# EAGLE design 2560_breakout (EAGLE 8.1.0)
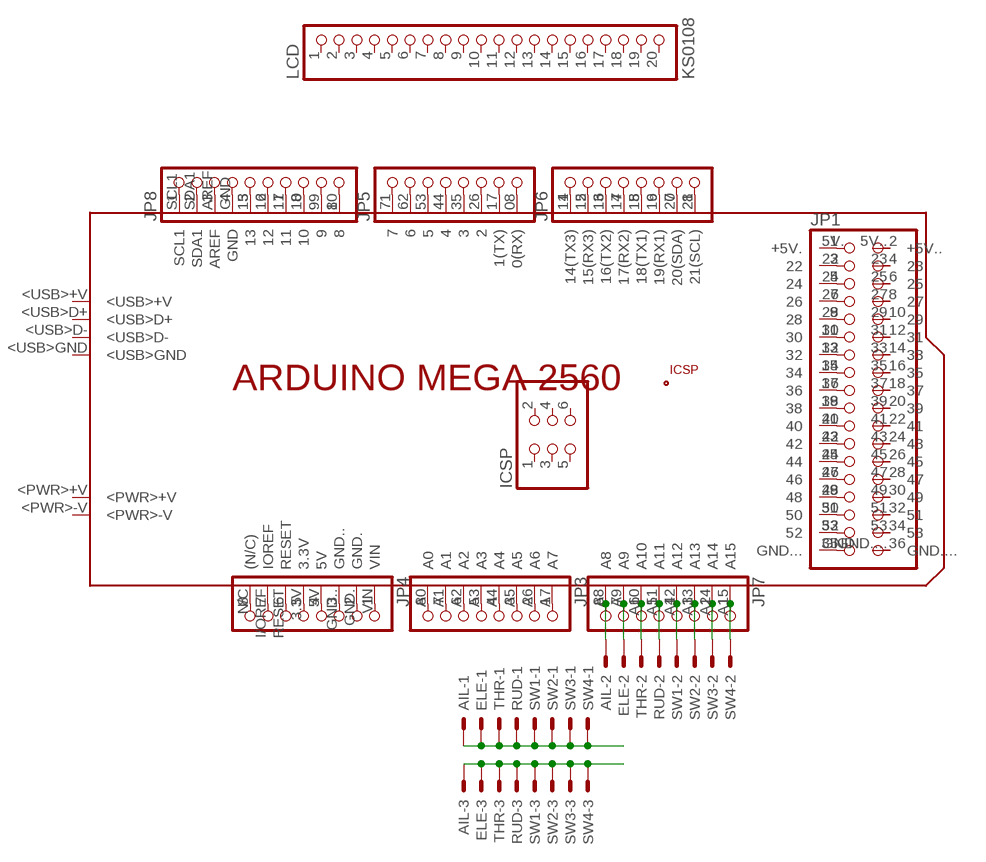
[diagram p0: schematic, sheet 1]

## Parts
AIL  JST-XH-03-PIN-LONG-PAD  [JST-XH-03-PACKAGE-LONG-PAD]
ELE  JST-XH-03-PIN-LONG-PAD  [JST-XH-03-PACKAGE-LONG-PAD]
ICSP  PINHD-2X3  [2X03]
JP1  PINHD-2X18  [2X18]
JP3  PINHD-1X8  [1X08]
JP4  PINHD-1X8  [1X08]
JP5  PINHD-1X8  [1X08]
JP6  PINHD-1X8  [1X08]
JP7  PINHD-1X8  [1X08]
JP8  PINHD-1X10  [1X10]
LCD  KS0108  PINHD-1X20  [1X20]
PCB1  ARDUINO_MEGA2560  [ARDUINO_MEGA2560]
RUD  JST-XH-03-PIN-LONG-PAD  [JST-XH-03-PACKAGE-LONG-PAD]
SW1  JST-XH-03-PIN-LONG-PAD  [JST-XH-03-PACKAGE-LONG-PAD]
SW2  JST-XH-03-PIN-LONG-PAD  [JST-XH-03-PACKAGE-LONG-PAD]
SW3  JST-XH-03-PIN-LONG-PAD  [JST-XH-03-PACKAGE-LONG-PAD]
SW4  JST-XH-03-PIN-LONG-PAD  [JST-XH-03-PACKAGE-LONG-PAD]
THR  JST-XH-03-PIN-LONG-PAD  [JST-XH-03-PACKAGE-LONG-PAD]

## Nets
N$1: JP1.1 PCB1.5V.(+5V.)
N$2: JP1.3 PCB1.22
N$3: JP1.5 PCB1.24
N$4: JP1.7 PCB1.26
N$5: JP1.9 PCB1.28
N$6: JP1.11 PCB1.30
N$7: JP1.13 PCB1.32
N$8: JP1.15 PCB1.34
N$9: JP1.17 PCB1.36
N$10: JP1.19 PCB1.38
N$11: JP1.21 PCB1.40
N$12: JP1.23 PCB1.42
N$13: JP1.25 PCB1.44
N$14: JP1.27 PCB1.46
N$15: JP1.29 PCB1.48
N$16: JP1.31 PCB1.50
N$17: JP1.33 PCB1.52
N$18: JP1.35 PCB1.GND...
N$19: JP6.1 PCB1.14(14(TX3))
N$20: JP6.2 PCB1.15(15(RX3))
N$21: JP6.3 PCB1.16(16(TX2))
N$22: JP6.4 PCB1.17(17(RX2))
N$23: JP6.5 PCB1.18(18(TX1))
N$24: JP6.6 PCB1.19(19(RX1))
N$25: JP6.7 PCB1.20(20(SDA))
N$26: JP6.8 PCB1.21(21(SCL))
N$27: JP5.1 PCB1.7
N$28: JP5.2 PCB1.6
N$29: JP5.3 PCB1.5
N$30: JP5.4 PCB1.4
N$31: JP5.5 PCB1.3
N$32: JP5.6 PCB1.2
N$33: JP5.7 PCB1.1(1(TX))
N$34: JP5.8 PCB1.0(0(RX))
N$35: JP8.1 PCB1.SCL1
N$36: JP8.2 PCB1.SDA1
N$37: JP8.3 PCB1.AREF
N$38: JP8.4 PCB1.GND
N$39: JP8.5 PCB1.13
N$40: JP8.6 PCB1.12
N$41: JP8.7 PCB1.11
N$42: JP8.8 PCB1.10
N$43: JP8.9 PCB1.9
N$44: JP8.10 PCB1.8
N$45: JP4.1 PCB1.VIN
N$46: JP4.2 PCB1.GND.
N$47: JP4.3 PCB1.GND..
N$48: JP4.4 PCB1.5V
N$49: JP4.5 PCB1.3.3V
N$50: JP4.6 PCB1.RESET
N$51: JP4.7 PCB1.I/OREF(IOREF)
N$52: JP4.8 PCB1.N/C((N/C))
N$53: JP3.1 PCB1.A7
N$54: JP3.2 PCB1.A6
N$55: JP3.3 PCB1.A5
N$56: JP3.4 PCB1.A4
N$57: JP3.5 PCB1.A3
N$58: JP3.6 PCB1.A2
N$59: JP3.7 PCB1.A1
N$60: JP3.8 PCB1.A0
N$61: JP7.1 PCB1.A15 SW4.2
N$62: JP7.2 PCB1.A14 SW3.2
N$63: JP7.3 PCB1.A13 SW2.2
N$64: JP7.4 PCB1.A12 SW1.2
N$65: JP7.5 PCB1.A11 RUD.2
N$66: JP7.6 PCB1.A10 THR.2
N$67: ELE.2 JP7.7 PCB1.A9
N$68: AIL.2 JP7.8 PCB1.A8
N$69: AIL.1 ELE.1 RUD.1 SW1.1 SW2.1 SW3.1 SW4.1 THR.1
N$70: AIL.3 ELE.3 RUD.3 SW1.3 SW2.3 SW3.3 SW4.3 THR.3
Unconnected: ICSP.1 ICSP.2 ICSP.3 ICSP.4 ICSP.5 ICSP.6 JP1.2 JP1.4 JP1.6 JP1.8 JP1.10 JP1.12 JP1.14 JP1.16 JP1.18 JP1.20 JP1.22 JP1.24 JP1.26 JP1.28 JP1.30 JP1.32 JP1.34 JP1.36 LCD.1 LCD.2 LCD.3 LCD.4 LCD.5 LCD.6 LCD.7 LCD.8 LCD.9 LCD.10 LCD.11 LCD.12 LCD.13 LCD.14 LCD.15 LCD.16 LCD.17 LCD.18 LCD.19 LCD.20 PCB1.5V..(+5V..) PCB1.23 PCB1.25 PCB1.27 PCB1.29 PCB1.31 PCB1.33 PCB1.35 PCB1.37 PCB1.39 PCB1.41 PCB1.43 PCB1.45 PCB1.47 PCB1.49 PCB1.51 PCB1.53 PCB1.+5V_ PCB1.<PWR>+V PCB1.<PWR>-V PCB1.<USB>+V PCB1.<USB>D+ PCB1.<USB>D- PCB1.<USB>GND PCB1.GND.... PCB1.GND__ PCB1.MISO PCB1.MOSI PCB1.RESET. PCB1.SCK

## Library data of the parts
AIL ELE RUD SW1-SW4 THR = Rembrandt Electronics - JST XH Connectors v1-0:JST-XH-03-PIN: JST XH Connector 2 Pin Wire to board connector. Pitch: 2,54 mm, (0.100") Number of pins: 3 Created by Rembrandt Electronics www.rembrandtelectronics.com
ICSP = pinhead:PINHD-2X3: PIN HEADER
JP1 = pinhead:PINHD-2X18: PIN HEADER
JP3-JP7 = pinhead:PINHD-1X8: PIN HEADER
JP8 = pinhead:PINHD-1X10: PIN HEADER
LCD = pinhead:PINHD-1X20: PIN HEADER
PCB1 = E14_Arduino_revC:ARDUINO_MEGA2560: Device for representing an Arduino Mega 2560 board with a footprint in an EAGLE design. Created by Dave Young for Element14. More EAGLE documentation at: http://www.element14.com/community/community/knode/cadsoft_eagle

## Board
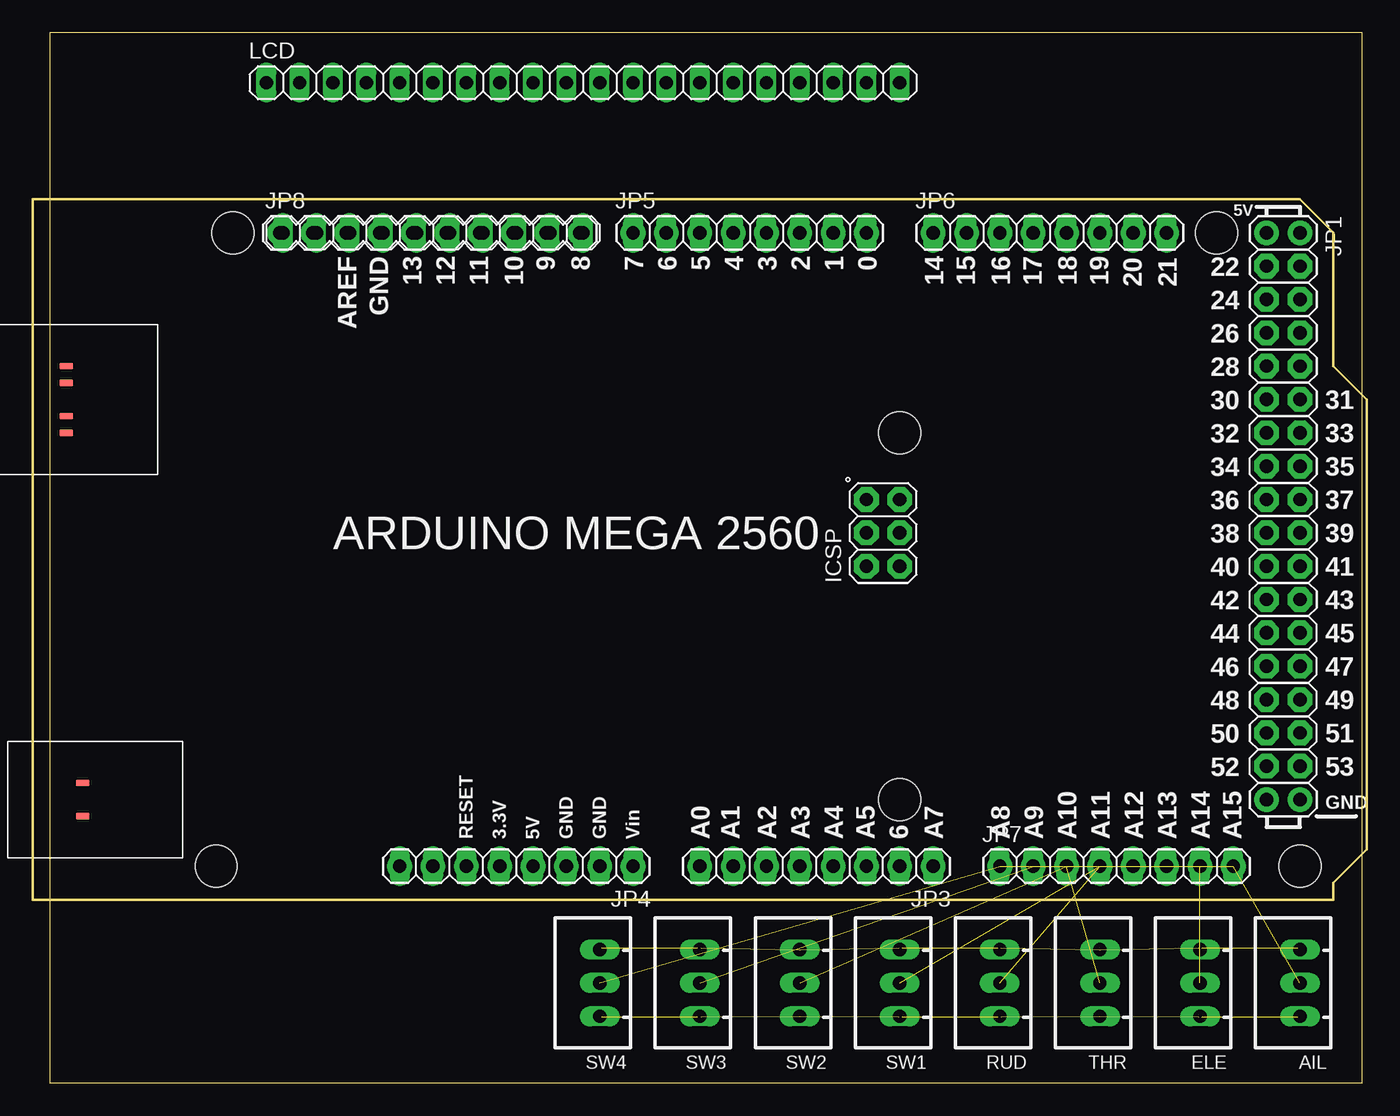
[diagram p1: board, top side]

Size 100 x 80 mm. Coordinates in mm from the lower left corner, seen from the top.
Outline: 0,0 100,0 100,80 0,80 0,0
Copper layers (1*16): Top 0.035mm / dielectric 1.5mm / Bottom 0.035mm
Design rules "default": minimum track width 10mil, minimum drill 24mil, track to track 8mil, track to pad 8mil, pad to pad 8mil, via to via 8mil, smd to smd 8mil, copper to edge 40mil, drill to drill 8mil, minimum pad ring 10mil, minimum via ring 8mil, stop-mask expansion 4mil, vias tented up to drill 0mil, thermal gap 10mil

### Footprints (pad centres in the part's own frame; a part is rotated, then mirrored left to right if it is on the bottom)
JST-XH-03-PACKAGE-LONG-PAD = drill 1.016 long: 1 -2.54,0; 2 0,0; 3 2.54,0
2X03 = drill 1.016 octagon: 1 -2.54,-1.27; 2 -2.54,1.27; 3 0,-1.27; 4 0,1.27; 5 2.54,-1.27; 6 2.54,1.27
2X18 = drill 1.016 octagon: 1 -21.59,-1.27; 2 -21.59,1.27; 3 -19.05,-1.27; 4 -19.05,1.27; 5 -16.51,-1.27; 6 -16.51,1.27; 7 -13.97,-1.27; 8 -13.97,1.27; 9 -11.43,-1.27; 10 -11.43,1.27; 11 -8.89,-1.27; 12 -8.89,1.27; 13 -6.35,-1.27; 14 -6.35,1.27; 15 -3.81,-1.27; 16 -3.81,1.27; 17 -1.27,-1.27; 18 -1.27,1.27; 19 1.27,-1.27; 20 1.27,1.27; 21 3.81,-1.27; 22 3.81,1.27; 23 6.35,-1.27; 24 6.35,1.27; 25 8.89,-1.27; 26 8.89,1.27; 27 11.43,-1.27; 28 11.43,1.27; 29 13.97,-1.27; 30 13.97,1.27; 31 16.51,-1.27; 32 16.51,1.27; 33 19.05,-1.27; 34 19.05,1.27; 35 21.59,-1.27; 36 21.59,1.27
1X08 = drill 1.016 long: 1 -8.89,0; 2 -6.35,0; 3 -3.81,0; 4 -1.27,0; 5 1.27,0; 6 3.81,0; 7 6.35,0; 8 8.89,0
1X10 = drill 1.016 long: 1 -11.43,0; 2 -8.89,0; 3 -6.35,0; 4 -3.81,0; 5 -1.27,0; 6 1.27,0; 7 3.81,0; 8 6.35,0; 9 8.89,0; 10 11.43,0
1X20 = drill 1.016 long: 1 -24.13,0; 2 -21.59,0; 3 -19.05,0; 4 -16.51,0; 5 -13.97,0; 6 -11.43,0; 7 -8.89,0; 8 -6.35,0; 9 -3.81,0; 10 -1.27,0; 11 1.27,0; 12 3.81,0; 13 6.35,0; 14 8.89,0; 15 11.43,0; 16 13.97,0; 17 16.51,0; 18 19.05,0; 19 21.59,0; 20 24.13,0
ARDUINO_MEGA2560 = drill 1.016 pad 1.88: 0 63.5,50.8; 1 60.96,50.8; 2 58.42,50.8; 3 55.88,50.8; 3.3V 35.56,2.54; 4 53.34,50.8; 5 50.8,50.8; 5V 38.1,2.54; 5V. 93.98,50.8; 5V.. 96.52,50.8; 6 48.26,50.8; 7 45.72,50.8; 8 41.656,50.8; 9 39.116,50.8; 10 36.576,50.8; 11 34.036,50.8; 12 31.496,50.8; 13 28.956,50.8; 14 68.58,50.8; 15 71.12,50.8; 16 73.66,50.8; 17 76.2,50.8; 18 78.74,50.8; 19 81.28,50.8; 20 83.82,50.8; 21 86.36,50.8; A0 50.8,2.54; A1 53.34,2.54; A2 55.88,2.54; A3 58.42,2.54; A4 60.96,2.54; A5 63.5,2.54; A6 66.04,2.54; A7 68.58,2.54; A8 73.66,2.54; A9 76.2,2.54; A10 78.74,2.54; A11 81.28,2.54; A12 83.82,2.54; A13 86.36,2.54; A14 88.9,2.54; A15 91.44,2.54; AREF 23.876,50.8; GND 26.416,50.8; GND. 43.18,2.54; GND.. 40.64,2.54; GND... 93.98,7.62; GND.... 96.52,7.62; I/OREF 30.48,2.54; N/C 27.94,2.54; RESET 33.02,2.54; SCL1 18.796,50.8; SDA1 21.336,50.8; VIN 45.72,2.54 | drill 1.016 pad 1.88 octagon: 22 93.98,48.26; 23 96.52,48.26; 24 93.98,45.72; 25 96.52,45.72; 26 93.98,43.18; 27 96.52,43.18; 28 93.98,40.64; 29 96.52,40.64; 30 93.98,38.1; 31 96.52,38.1; 32 93.98,35.56; 33 96.52,35.56; 34 93.98,33.02; 35 96.52,33.02; 36 93.98,30.48; 37 96.52,30.48; 38 93.98,27.94; 39 96.52,27.94; 40 93.98,25.4; 41 96.52,25.4; 42 93.98,22.86; 43 96.52,22.86; 44 93.98,20.32; 45 96.52,20.32; 46 93.98,17.78; 47 96.52,17.78; 48 93.98,15.24; 49 96.52,15.24; 50 93.98,12.7; 51 96.52,12.7; 52 93.98,10.16; 53 96.52,10.16; +5V_ 66.04,30.48; GND__ 66.04,25.4; MISO 63.5,30.48; MOSI 66.04,27.94; RESET. 63.5,25.4; SCK 63.5,27.94 | smd 1.016 x 0.508: <PWR>+V 3.81,8.89; <PWR>-V 3.81,6.35; <USB>+V 2.54,40.64; <USB>D+ 2.54,39.37; <USB>D- 2.54,36.83; <USB>GND 2.54,35.56 | hole 3.2: 15.24,50.8; 13.97,2.54; 66.04,35.56; 66.04,7.62; 90.17,50.8; 96.52,2.54

### Placement (x,y rotation side)
AIL  95.25,7.62 90 top
ELE  87.63,7.62 90 top
ICSP  63.5,41.91 90 top
JP1  93.98,43.18 270 top
JP3  58.42,16.51 180 top
JP4  35.56,16.51 180 top
JP5  53.34,64.77 0 top
JP6  76.2,64.77 0 top
JP7  81.28,16.51 0 top
JP8  29.21,64.77 0 top
LCD  40.64,76.2 0 top
PCB1  -1.27,13.97 0 top
RUD  72.39,7.62 90 top
SW1  64.77,7.62 90 top
SW2  57.15,7.62 90 top
SW3  49.53,7.62 90 top
SW4  41.91,7.62 90 top
THR  80.01,7.62 90 top

### Tracks (layer width: path | path; a pad name or v marks a point on that pad's centre or on a via)
N$35
  Top 0.254: JP8.1 17.6,64.92 PCB1.SCL1
N$36
  Top 0.254: JP8.2 20.12,64.92 PCB1.SDA1
N$37
  Top 0.254: JP8.3 22.86,64.92 22.63,64.92 PCB1.AREF
N$38
  Top 0.254: JP8.4 25.38,64.92 25.15,64.92 PCB1.GND
N$39
  Top 0.254: JP8.5 27.89,64.92 PCB1.13
N$40
  Top 0.254: JP8.6 30.4,64.92 PCB1.12
N$41
  Top 0.254: JP8.7 32.92,64.92 PCB1.11
N$42
  Top 0.254: JP8.8 35.43,64.92 PCB1.10
N$43
  Top 0.254: JP8.9 37.95,64.92 PCB1.9
N$44
  Top 0.254: JP8.10 40.46,64.92 PCB1.8
N$61  (2 unrouted)
N$62  (2 unrouted)
N$63  (2 unrouted)
N$64  (2 unrouted)
N$65  (2 unrouted)
N$66  (2 unrouted)
N$67  (2 unrouted)
N$68  (2 unrouted)
N$69  (7 unrouted)
  Top 0.254: 42.06,5.03 SW4.1 | 49.38,5.03 SW3.1 49.61,5.03 | 87.78,5.03 ELE.1 87.55,5.03 | 95.1,5.03 AIL.1 | 64.92,5.03 SW1.1 64.69,5.03 | 72.24,5.03 RUD.1 72.47,5.03 | 80.01,5.03 THR.1 | 57.15,5.03 SW2.1
N$70  (7 unrouted)
  Top 0.254: 42.06,10.29 SW4.3 | 49.38,10.29 SW3.3 49.61,10.29 | 87.78,10.29 ELE.3 87.55,10.29 | 95.1,10.29 AIL.3 | 64.92,10.29 SW1.3 64.69,10.29 | 72.24,10.29 RUD.3 72.47,10.29 | 80.01,10.29 THR.3 | 57.15,10.29 SW2.3